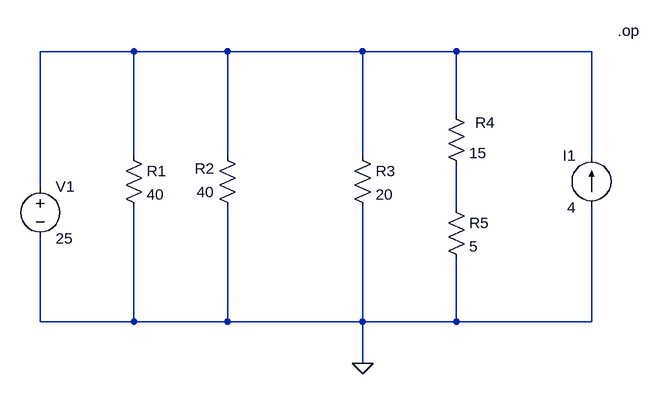
[diagram p0: schematic close.asc]
close.asc, the LTspice schematic file:
Version 4
SHEET 1 912 680
WIRE 128 32 -16 32
WIRE 272 32 128 32
WIRE 480 32 272 32
WIRE 624 32 480 32
WIRE 832 32 624 32
WIRE 624 128 624 32
WIRE 128 192 128 32
WIRE 272 192 272 32
WIRE 480 192 480 32
WIRE 832 192 832 32
WIRE -16 240 -16 32
WIRE 624 272 624 208
WIRE -16 448 -16 320
WIRE 128 448 128 272
WIRE 128 448 -16 448
WIRE 272 448 272 272
WIRE 272 448 128 448
WIRE 480 448 480 272
WIRE 480 448 272 448
WIRE 624 448 624 352
WIRE 624 448 480 448
WIRE 832 448 832 272
WIRE 832 448 624 448
WIRE 480 512 480 448
FLAG 480 512 0
SYMBOL voltage -16 224 R0
SYMATTR InstName V1
SYMATTR Value 25
SYMBOL res 112 176 R0
SYMATTR InstName R1
SYMATTR Value 40
SYMBOL res 288 288 R180
WINDOW 0 36 76 Left 2
WINDOW 3 36 40 Left 2
SYMATTR InstName R2
SYMATTR Value 40
SYMBOL res 464 176 R0
SYMATTR InstName R3
SYMATTR Value 20
SYMBOL res 608 112 R0
WINDOW 0 45 29 Left 2
SYMATTR InstName R4
SYMATTR Value 15
SYMBOL current 832 272 R180
WINDOW 0 24 80 Left 2
WINDOW 3 24 0 Left 2
WINDOW 123 0 0 Left 0
WINDOW 39 0 0 Left 0
SYMATTR InstName I1
SYMATTR Value 4
SYMBOL res 608 256 R0
SYMATTR InstName R5
SYMATTR Value 5
TEXT 872 0 Left 2 !.op

The netlist it stands for:
* close.asc
V1 N001 0 25
R1 N001 0 40
R2 0 N001 40
R3 N001 0 20
R4 N001 N002 15
I1 0 N001 4
R5 N002 0 5
.op
.backanno
.end